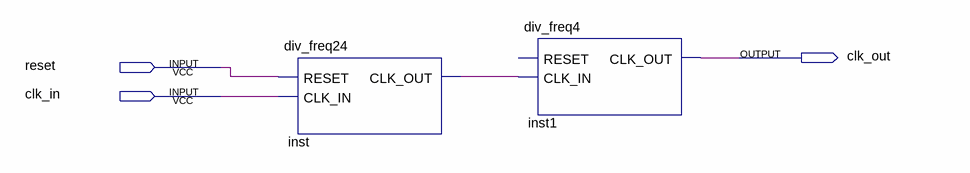
[diagram p0: schematic sheet]
// Quartus schematic div_freq26.bdf as structural Verilog: 2 symbols, 3 pins
module div_freq26 (
  input  reset,
  input  clk_in,
  output clk_out
);

  wire inst_clk_out;

  div_freq24 inst (.RESET(reset), .CLK_IN(clk_in), .CLK_OUT(inst_clk_out));
  div_freq4 inst1 (.CLK_IN(inst_clk_out), .CLK_OUT(clk_out));  // open: RESET
endmodule
